# Altium schematic sheet ADRF6780Dev.SchDoc
size A3
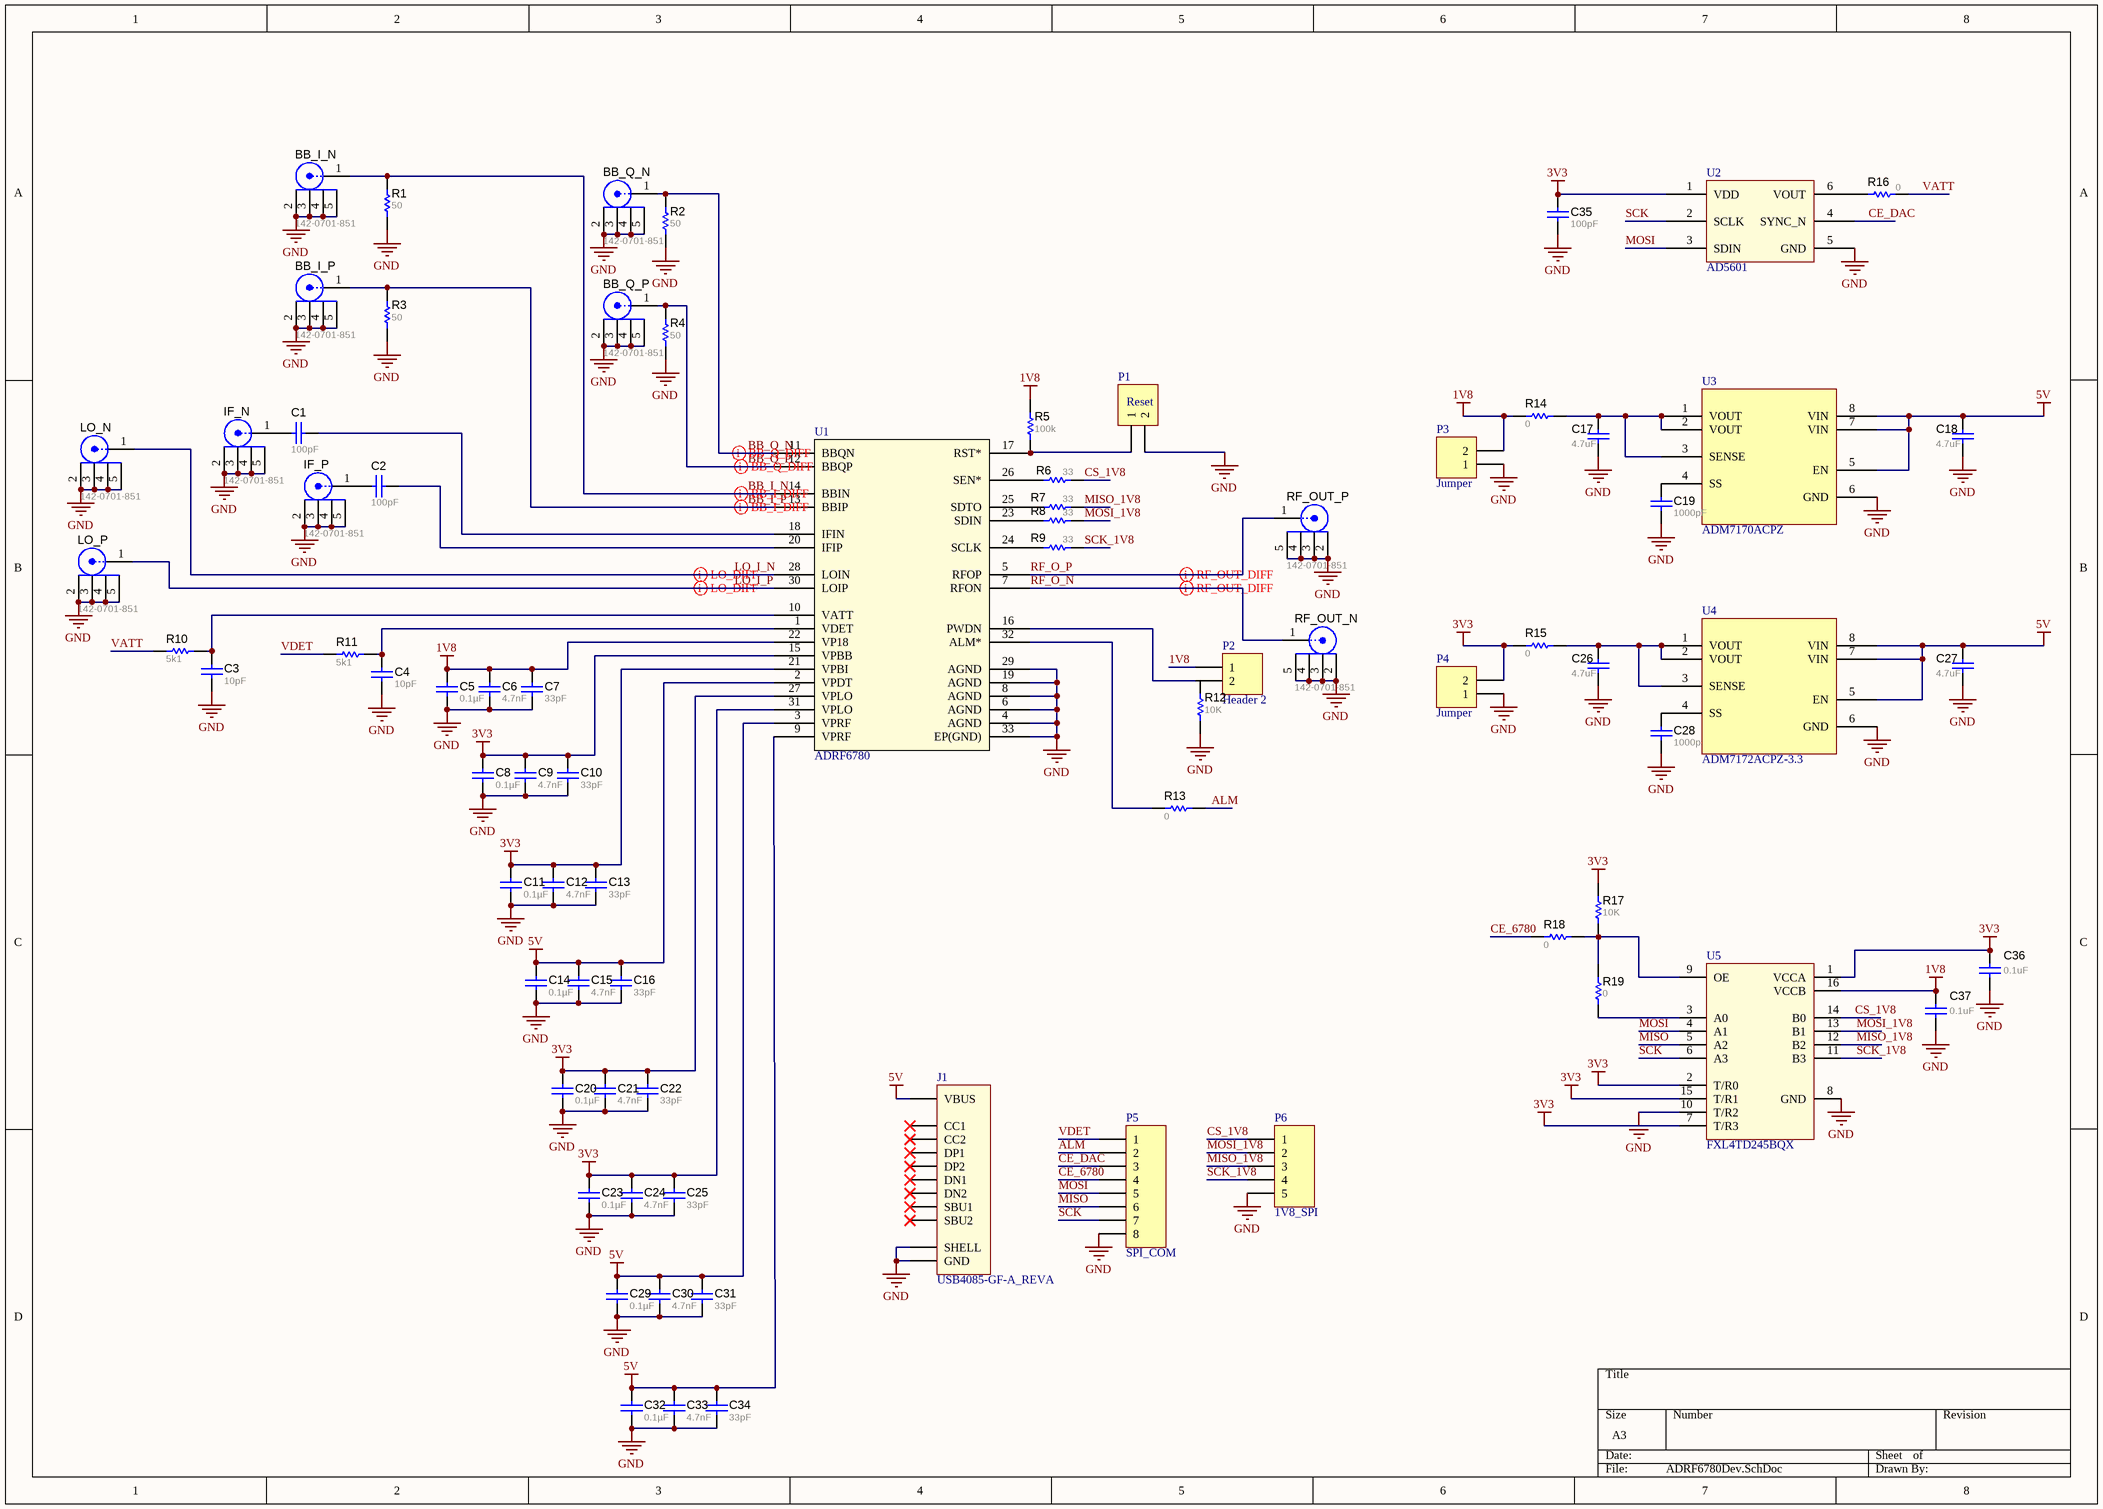
[diagram p0: ADRF6780Dev.SchDoc]

## Parts
BB_I_N  142-0701-851  [Emerson_142-0701-851]
BB_I_P  142-0701-851  [Emerson_142-0701-851]
BB_Q_N  142-0701-851  [Emerson_142-0701-851]
BB_Q_P  142-0701-851  [Emerson_142-0701-851]
C1  ValueDisplayed: 100pF  [0603]  (hidden comment: C0603C101J5GACTU)
C2  ValueDisplayed: 100pF  [0603]  (hidden comment: C0603C101J5GACTU)
C3  ValueDisplayed: 10pF  [0603]  (hidden comment: C1608X5R1A106M080AC)
C4  ValueDisplayed: 10pF  [0603]  (hidden comment: C1608X5R1A106M080AC)
C5  ValueDisplayed: 0.1µF  [0603]  (hidden comment: C1608X5R1A106M080AC)
C6  ValueDisplayed: 4.7nF  [0603]  (hidden comment: C1608X5R1A106M080AC)
C7  ValueDisplayed: 33pF  [0603]  (hidden comment: C1608X5R1A106M080AC)
C8  ValueDisplayed: 0.1µF  [0603]  (hidden comment: C1608X5R1A106M080AC)
C9  ValueDisplayed: 4.7nF  [0603]  (hidden comment: C1608X5R1A106M080AC)
C10  ValueDisplayed: 33pF  [0603]  (hidden comment: C1608X5R1A106M080AC)
C11  ValueDisplayed: 0.1µF  [0603]  (hidden comment: C1608X5R1A106M080AC)
C12  ValueDisplayed: 4.7nF  [0603]  (hidden comment: C1608X5R1A106M080AC)
C13  ValueDisplayed: 33pF  [0603]  (hidden comment: C1608X5R1A106M080AC)
C14  ValueDisplayed: 0.1µF  [0603]  (hidden comment: C1608X5R1A106M080AC)
C15  ValueDisplayed: 4.7nF  [0603]  (hidden comment: C1608X5R1A106M080AC)
C16  ValueDisplayed: 33pF  [0603]  (hidden comment: C1608X5R1A106M080AC)
C17  ValueDisplayed: 4.7uF  [0603]  (hidden comment: C0603C472J5RACTU)
C18  ValueDisplayed: 4.7uF  [0603]  (hidden comment: C0603C472J5RACTU)
C19  ValueDisplayed: 1000pF  [0603]  (hidden comment: C0603C472J5RACTU)
C20  ValueDisplayed: 0.1µF  [0603]  (hidden comment: C1608X5R1A106M080AC)
C21  ValueDisplayed: 4.7nF  [0603]  (hidden comment: C1608X5R1A106M080AC)
C22  ValueDisplayed: 33pF  [0603]  (hidden comment: C1608X5R1A106M080AC)
C23  ValueDisplayed: 0.1µF  [0603]  (hidden comment: C1608X5R1A106M080AC)
C24  ValueDisplayed: 4.7nF  [0603]  (hidden comment: C1608X5R1A106M080AC)
C25  ValueDisplayed: 33pF  [0603]  (hidden comment: C1608X5R1A106M080AC)
C26  ValueDisplayed: 4.7uF  [0603]  (hidden comment: C0603C472J5RACTU)
C27  ValueDisplayed: 4.7uF  [0603]  (hidden comment: C0603C472J5RACTU)
C28  ValueDisplayed: 1000pF  [0603]  (hidden comment: C0603C472J5RACTU)
C29  ValueDisplayed: 0.1µF  [0603]  (hidden comment: C1608X5R1A106M080AC)
C30  ValueDisplayed: 4.7nF  [0603]  (hidden comment: C1608X5R1A106M080AC)
C31  ValueDisplayed: 33pF  [0603]  (hidden comment: C1608X5R1A106M080AC)
C32  ValueDisplayed: 0.1µF  [0603]  (hidden comment: C1608X5R1A106M080AC)
C33  ValueDisplayed: 4.7nF  [0603]  (hidden comment: C1608X5R1A106M080AC)
C34  ValueDisplayed: 33pF  [0603]  (hidden comment: C1608X5R1A106M080AC)
C35  ValueDisplayed: 100pF  [0603]  (hidden comment: C0603C101J5GACTU)
C36  ValueDisplayed: 0.1uF  [0603]  (hidden comment: C0603C472J5RACTU)
C37  ValueDisplayed: 0.1uF  [0603]  (hidden comment: C0603C472J5RACTU)
IF_N  142-0701-851  [Emerson_142-0701-851]
IF_P  142-0701-851  [Emerson_142-0701-851]
J1  USB4085-GF-A_REVA  [GCT_USB4085-GF-A_REVA]
LO_N  142-0701-851  [Emerson_142-0701-851]
LO_P  142-0701-851  [Emerson_142-0701-851]
P1  Reset  [HDR1X2]
P2  Header 2  [HDR1X2]
P3  Jumper  [HDR1X2]
P4  Jumper  [HDR1X2]
P5  SPI_COM  [HDR1X8]
P6  1V8_SPI  [HDR1X5]
R1  ValueDisplayed: 50  [0603]  (hidden comment: CRCW0603100KJNEA)
R2  ValueDisplayed: 50  [0603]  (hidden comment: CRCW0603100KJNEA)
R3  ValueDisplayed: 50  [0603]  (hidden comment: CRCW0603100KJNEA)
R4  ValueDisplayed: 50  [0603]  (hidden comment: CRCW0603100KJNEA)
R5  ValueDisplayed: 100k  [0603]  (hidden comment: CRCW0603100KJNEA)
R6  ValueDisplayed: 33  [0603]  (hidden comment: CRCW0603100KJNEA)
R7  ValueDisplayed: 33  [0603]  (hidden comment: CRCW0603100KJNEA)
R8  ValueDisplayed: 33  [0603]  (hidden comment: CRCW0603100KJNEA)
R9  ValueDisplayed: 33  [0603]  (hidden comment: CRCW0603100KJNEA)
R10  ValueDisplayed: 5k1  [0603L]  (hidden comment: CRCW0603100RFKEA)
R11  ValueDisplayed: 5k1  [0603L]  (hidden comment: CRCW0603100RFKEA)
R12  ValueDisplayed: 10K  [0603]  (hidden comment: CRCW0603100KJNEA)
R13  ValueDisplayed: 0  [0603]  (hidden comment: CRCW0603100KJNEA)
R14  ValueDisplayed: 0  [0603]  (hidden comment: CRCW06030000Z0EA)
R15  ValueDisplayed: 0  [0603]  (hidden comment: CRCW06030000Z0EA)
R16  ValueDisplayed: 0  [0603]  (hidden comment: CRCW0603100KJNEA)
R17  ValueDisplayed: 10K  [0603]  (hidden comment: CRCW06030000Z0EA)
R18  ValueDisplayed: 0  [0603]  (hidden comment: CRCW06030000Z0EA)
R19  ValueDisplayed: 0  [0603]  (hidden comment: CRCW06030000Z0EA)
RF_OUT_N  142-0701-851  [Emerson_142-0701-851]
RF_OUT_P  142-0701-851  [Emerson_142-0701-851]
U1  ADRF6780  [ADRF6780]
U2  AD5601  [AD5601/AD5611/AD5621]
U3  ADM7170ACPZ  [ADM7170ACPZ]
U4  ADM7172ACPZ-3.3  [ADM7170ACPZ]
U5  FXL4TD245BQX  [DQFN-16]

## Nets
1V8: C5.1 C6.1 C7.1 C37.1 P2.1 P3.2 R5.2 R14.1 U1.22(VP18) U5.16(VCCB)
3V3: C8.1 C9.1 C10.1 C11.1 C12.1 C13.1 C20.1 C21.1 C22.1 C23.1 C24.1 C25.1 C35.1 C36.1 P4.2 R15.1 R17.2 U1.15(VPBB) U1.21(VPBI) U1.27(VPLO) U1.31(VPLO) U2.1(VDD) U5.1(VCCA) U5.2(T/R0) U5.7(T/R3) U5.15(T/R1)
5V: C14.1 C15.1 C16.1 C18.1 C27.1 C29.1 C30.1 C31.1 C32.1 C33.1 C34.1 J1.V(VBUS) U1.2(VPDT) U1.3(VPRF) U1.9(VPRF) U3.5(EN) U3.7(VIN) U3.8(VIN) U4.5(EN) U4.7(VIN) U4.8(VIN)
GND: BB_I_N.2 BB_I_N.3 BB_I_N.4 BB_I_N.5 BB_I_P.2 BB_I_P.3 BB_I_P.4 BB_I_P.5 BB_Q_N.2 BB_Q_N.3 BB_Q_N.4 BB_Q_N.5 BB_Q_P.2 BB_Q_P.3 BB_Q_P.4 BB_Q_P.5 C3.2 C4.2 C5.2 C6.2 C7.2 C8.2 C9.2 C10.2 C11.2 C12.2 C13.2 C14.2 C15.2 C16.2 C17.2 C18.2 C19.2 C20.2 C21.2 C22.2 C23.2 C24.2 C25.2 C26.2 C27.2 C28.2 C29.2 C30.2 C31.2 C32.2 C33.2 C34.2 C35.2 C36.2 C37.2 IF_N.2 IF_N.3 IF_N.4 IF_N.5 IF_P.2 IF_P.3 IF_P.4 IF_P.5 J1.G(GND) J1.P(SHELL) LO_N.2 LO_N.3 LO_N.4 LO_N.5 LO_P.2 LO_P.3 LO_P.4 LO_P.5 P1.2 P3.1 P4.1 P5.8 P6.5 R1.1 R2.1 R3.1 R4.1 R12.1 RF_OUT_N.2 RF_OUT_N.3 RF_OUT_N.4 RF_OUT_N.5 RF_OUT_P.2 RF_OUT_P.3 RF_OUT_P.4 RF_OUT_P.5 U1.4(AGND) U1.6(AGND) U1.8(AGND) U1.19(AGND) U1.29(AGND) U1.33(EP(GND)) U2.5(GND) U3.6(GND) U4.6(GND) U5.8(GND) U5.10(T/R2)
ALM: P5.2 R13.2
BB_I_N: BB_I_N.1 R1.2 U1.14(BBIN)
BB_I_P: BB_I_P.1 R3.2 U1.13(BBIP)
BB_Q_N: BB_Q_N.1 R2.2 U1.11(BBQN)
BB_Q_P: BB_Q_P.1 R4.2 U1.12(BBQP)
CE_6780: P5.4 R18.2
CE_DAC: P5.3 U2.4(SYNC_N)
CS_1V8: P6.1 R6.2 U5.14(B0)
LO_I_N: LO_N.1 U1.28(LOIN)
LO_I_P: LO_P.1 U1.30(LOIP)
MISO: P5.6 U5.5(A2)
MISO_1V8: P6.3 R7.2 U5.12(B2)
MOSI: P5.5 U2.3(SDIN) U5.4(A1)
MOSI_1V8: P6.2 R8.2 U5.13(B1)
RF_O_N: RF_OUT_N.1 U1.7(RFON)
RF_O_P: RF_OUT_P.1 U1.5(RFOP)
SCK: P5.7 U2.2(SCLK) U5.6(A3)
SCK_1V8: P6.4 R9.2 U5.11(B3)
VATT: R10.1 R16.1
VDET: P5.1 R11.1
NetC1_1: C1.1 U1.18(IFIN)
NetC1_2: C1.2 IF_N.1
NetC2_1: C2.1 U1.20(IFIP)
NetC2_2: C2.2 IF_P.1
NetC3_1: C3.1 R10.2 U1.10(VATT)
NetC4_1: C4.1 R11.2 U1.1(VDET)
NetC17_1: C17.1 R14.2 U3.1(VOUT) U3.2(VOUT) U3.3(SENSE)
NetC19_1: C19.1 U3.4(SS)
NetC26_1: C26.1 R15.2 U4.1(VOUT) U4.2(VOUT) U4.3(SENSE)
NetC28_1: C28.1 U4.4(SS)
NetP1_1: P1.1 R5.1 U1.17(RST*)
NetP2_2: P2.2 U1.16(PWDN)
NetR6_1: R6.1 U1.26(SEN*)
NetR7_1: R7.1 U1.25(SDTO)
NetR8_1: R8.1 U1.23(SDIN)
NetR9_1: R9.1 U1.24(SCLK)
NetR13_1: R13.1 U1.32(ALM*)
NetR16_2: R16.2 U2.6(VOUT)
NetR17_1: R17.1 R18.1 R19.2 U5.9(OE)
NetR19_1: R19.1 U5.3(A0)

Not connected (* = marked no-connect by the designer): J1 A5(CC1)* A6(DP1)* A7(DN1)* A8(SBU1)* B5(CC2)* B6(DP2)* B7(DN2)* B8(SBU2)*; R12 2

## Layout directives
differential pair; differential pair class RF_OUT: RF_O_N, RF_O_P
differential pair; differential pair class LO_DIFF: LO_I_N, LO_I_P
differential pair; differential pair class BB_Q_DIFF: BB_Q_N, BB_Q_P
differential pair; differential pair class BB_I_DIFF: BB_I_N, BB_I_P

## Library data of the parts
BB_I_N BB_I_P BB_Q_N BB_Q_P IF_N IF_P LO_N LO_P RF_OUT_N RF_OUT_P = 142-0701-851: Connector, SMT, End launch SMA 50 ohm; Manufacturer: Emerson Network Power Connectivity; U/M: EA; PartNumber: 142-0701-851; CompType: Connector; DigiKeyPartNumber: J658-ND; Supplier 1: Newark; Supplier Part Number 1: 99F6798; RoHS: Y; PackageReference: SMA; MountType: SMT; ComponentLink1Description: Datasheet Link; ComponentLink1URL: https://emersonconnectivity.com/OA_MEDIA/specs/pi-1420701851.pdf; Publisher: National Semiconductor; LatestRevisionDate: 2011-04-27; LatestRevisionNote: Added Alternate PartNumber and Alternate Manufacturer parameters.; Alternate Manufacturer: -; Alternate PartNumber: -
C1 C2 C35 = C0603C101J5GACTU: CAP, CERM, 100 pF, 50 V, +/- 5%, C0G/NP0, 0603; Manufacturer: Kemet; Polarized: N; TaMax_C: 125; TaMin_C: -55; Tolerance_%: 5; VDC_V: 50; Cap_F: 0.0000000001; CompType: Capacitor; Value: 100pF; Value1: Unknown; Value2: 50V; U/M: EA; SizeArea_mm2: 1.28; SizeAreaWB_mm2: 4.68; SizeX_mm: 1.6; SizeY_mm: 0.8; SizeZ_mm: 1; AEC Category: Q200; Cap_Case: 0603; MountType: SMT; Technology: Ceramic; PartNumber: C0603C101J5GACTU; SymbolVersion: 2008-07-09; RoHS: Y; PackageReference: 0603; Published: 2008-06-19; Publisher: Texas Instruments; LatestRevisionDate: 2016-11-28; ComponentLink1Description: Datasheet link; ComponentLink1URL: http://www.kemet.com/kemet/web/homepage/kechome.nsf/vapubfiles/F3102_Y5V.pdf/$file/F3102_Y5V.pdf; TempCo: C0G/NP0; Supplier 1: Digi-Key; Supplier Part Number 1: 399-1061-1-ND; Supplier 2: Mouser; Supplier Part Number 2: 80-C0603C101J5G; Supplier 3: Farnell; Supplier Part Number 3: 1414603; AEC Qualified: ?
C3-C16 C20-C25 C29-C34 = C1608X5R1A106M080AC: CAP, CERM, 10 µF, 10 V, +/- 20%, X5R, 0603; Manufacturer: TDK; ESR_ohm: 0.0078; IRMS_A: 1.85; Polarized: N; TaMax_C: 85; TaMin_C: -55; Tolerance_%: 20; VDC_V: 10; Cap_F: 0.00001; CompType: Capacitor; Value: 10uF; U/M: EA; Value1: 0.0078 ohm; Value2: 10V; AEC Category: Q200; Cap_Case: 0603; MountType: SMT; Technology: Ceramic; PartNumber: C1608X5R1A106M080AC; SymbolVersion: 2008-07-09; RoHS: Y; PackageReference: 0603; Published: 2008-06-19; Publisher: Texas Instruments; LatestRevisionDate: 2016-03-08; ComponentLink1Description: Datasheet link; ComponentLink1URL: http://www.tdk.com/pdf/general_B11.pdf; TempCo: X5R; Supplier 1: Digi-Key; Supplier Part Number 1: 445-6853-1-ND; Supplier 2: Mouser; Supplier Part Number 2: 810-C1608X5R1A106M; Supplier 3: Farnell; Supplier Part Number 3: 1962113; AEC Qualified: ?
C17-C19 C26-C28 C36 C37 = C0603C472J5RACTU: CAP, CERM, 4700 pF, 50 V, +/- 5%, X7R, 0603; Manufacturer: Kemet; Polarized: N; TaMax_C: 125; TaMin_C: -55; Tolerance_%: 5; VDC_V: 50; Cap_F: 0.0000000047; CompType: Capacitor; Value: 4700pF; Value1: Unknown; Value2: 50V; U/M: EA; AEC Category: Q200; SizeArea_mm2: 1.28; SizeAreaWB_mm2: 4.68; SizeX_mm: 1.6; SizeY_mm: 0.8; SizeZ_mm: 1; Cap_Case: 0603; MountType: SMT; Technology: Ceramic; PartNumber: C0603C472J5RACTU; SymbolVersion: 2008-07-09; RoHS: Y; PackageReference: 0603; Published: 2008-06-19; Publisher: Texas Instruments; LatestRevisionDate: 2016-11-28; ComponentLink1Description: Datasheet link; ComponentLink1URL: http://www.kemet.com/kemet/web/homepage/kechome.nsf/vapubfiles/F3102_Y5V.pdf/$file/F3102_Y5V.pdf; TempCo: X7R; Supplier 1: Digi-Key; Supplier Part Number 1: 399-1088-1-ND; Supplier 2: Mouser; Supplier Part Number 2: 80-C0603C472J5R; Supplier 3: Farnell; Supplier Part Number 3: 9934952; AEC Qualified: ?
J1 = USB4085-GF-A_REVA: USB-C (USB TYPE-C) USB 2.0 Receptacle Connector 24 (16+8 Dummy) Position Through Hole, Right Angle, low cost, 3.46mm profile, 16 pin, horizontal, Top mount; MF: Global Connector Technology; SnapEDA_Link: https://www.snapeda.com/parts/USB4085-GF-A/Global%20Connector%20Technology/view-part/2780390/?ref=snap; Check_prices: https://www.snapeda.com/parts/USB4085-GF-A/Global%20Connector%20Technology/view-part/2780390/?ref=eda; Price: None; MP: USB4085-GF-A; Value: *; Purchase-URL: https://pricing.snapeda.com/search/part/USB4085-GF-A/?ref=eda; Availability: Warning; Package: Package
P1-P4 = Header 2: Header, 2-Pin; LatestRevisionDate: 17-Jul-2002; LatestRevisionNote: Re-released for DXP Platform.; Publisher: Altium Limited
P5 = Header 8: Header, 8-Pin; LatestRevisionDate: 17-Jul-2002; LatestRevisionNote: Re-released for DXP Platform.; Publisher: Altium Limited
P6 = Header 5: Header, 5-Pin; LatestRevisionDate: 17-Jul-2002; LatestRevisionNote: Re-released for DXP Platform.; Publisher: Altium Limited
R1-R9 R12 R13 R16 = CRCW0603100KJNEA: RES, 100 k, 5%, 0.1 W, 0603; Manufacturer: Vishay-Dale; CompType: Resistor; Tolerance_%: 5; VDC_V: 75; Power_W: 0.1; Res_ohm: 100000; Value: 100k; U/M: EA; Value2: 0.1W; EIA_Code: E24; TempCo: 200 ppm/C; SizeArea_mm2: 1.28; SizeX_mm: 1.6; SizeY_mm: 0.8; SizeZ_mm: 1; AEC Category: Q200; PartNumber: CRCW0603100KJNEA; SymbolVersion: 2009-05-29; Technology: Thick Film; MountType: SMT; RoHS: Y; PackageReference: 0603; ComponentLink1Description: Datasheet link; ComponentLink1URL: http://www.vishay.com/docs/20035/dcrcwe3.pdf; Publisher: Texas Instruments; LatestRevisionDate: 2016-06-02; Value_Code: 100k; Value1: 5%; Published: 2008-06-26; Supplier 1: Digi-Key; Supplier Part Number 1: 541-100KGCT-ND; Supplier 2: Mouser; Supplier Part Number 2: 71-CRCW0603J-100K-E3; Supplier 3: Farnell; Supplier Part Number 3: 1692517; AEC Qualified: ?
R10 R11 = CRCW0603100RFKEA: RES, 100, 1%, 0.1 W, 0603; Manufacturer: Vishay-Dale; CompType: Resistor; Tolerance_%: 1; VDC_V: 75; Power_W: 0.1; Res_ohm: 100; Value: 100; U/M: EA; Value_Code: 100R; Value2: 0.1W; EIA_Code: E96; TempCo: 100 ppm/C; SizeArea_mm2: 1.28; SizeX_mm: 1.6; SizeY_mm: 0.8; AEC Category: Q200; PartNumber: CRCW0603100RFKEA; SymbolVersion: 2009-05-29; Technology: Thick Film; MountType: SMT; RoHS: Y; PackageReference: 0603; ComponentLink1Description: Datasheet link; ComponentLink1URL: http://www.vishay.com/docs/20035/dcrcwe3.pdf; Publisher: Texas Instruments; LatestRevisionDate: 2016-11-02; Value1: 1%; Published: 2008-06-26; Supplier 1: Digi-Key; Supplier Part Number 1: 541-100HCT-ND; SizeZ_mm: 1; Supplier 2: Mouser; Supplier Part Number 2: 71-CRCW0603-100-E3; Supplier 3: Farnell; Supplier Part Number 3: 1469752; AEC Qualified: ?
R14 R15 R18 R19 = CRCW06030000Z0EA: RES, 0, 5%, 0.1 W, 0603; Manufacturer: Vishay-Dale; CompType: Resistor; Tolerance_%: 5; VDC_V: 75; Power_W: 0.1; Value: 0; U/M: EA; Value_Code: 0000; Value2: 0.1W; EIA_Code: E24; TempCo: 200 ppm/C; SizeArea_mm2: 1.28; SizeX_mm: 1.6; SizeY_mm: 0.8; SizeZ_mm: 1; AEC Category: Q200; PartNumber: CRCW06030000Z0EA; SymbolVersion: 2009-05-29; Res_ohm: 0; Technology: Thick Film; MountType: SMT; RoHS: Y; PackageReference: 0603; ComponentLink1Description: Datasheet link; ComponentLink1URL: http://www.vishay.com/docs/20035/dcrcwe3.pdf; Publisher: Texas Instruments; LatestRevisionDate: 2016-11-02; Value1: 5%; Published: 2008-06-26; Supplier 1: Digi-Key; Supplier Part Number 1: 541-0.0GCT-ND; Supplier 2: Mouser; Supplier Part Number 2: 71-CRCW0603-0-E3; Supplier 3: Farnell; Supplier Part Number 3: 1469739; AEC Qualified: ?
R17 = CRCW06030000Z0EA: RES, 0, 5%, 0.1 W, 0603; Manufacturer: Vishay-Dale; CompType: Resistor; Tolerance_%: 5; VDC_V: 75; Power_W: 0.1; Res_ohm: 0; Value: 0; U/M: EA; Value_Code: 0000; Value2: 0.1W; EIA_Code: E24; TempCo: 200 ppm/C; SizeArea_mm2: 1.28; SizeX_mm: 1.6; SizeY_mm: 0.8; SizeZ_mm: 1; AEC Category: Q200; PartNumber: CRCW06030000Z0EA; SymbolVersion: 2009-05-29; Technology: Thick Film; MountType: SMT; RoHS: Y; PackageReference: 0603; ComponentLink1Description: Datasheet link; ComponentLink1URL: http://www.vishay.com/docs/20035/dcrcwe3.pdf; Publisher: Texas Instruments; LatestRevisionDate: 2016-11-02; Value1: 5%; Published: 2008-06-26; Supplier 1: Digi-Key; Supplier Part Number 1: 541-0.0GCT-ND; Supplier 2: Mouser; Supplier Part Number 2: 71-CRCW0603-0-E3; Supplier 3: Farnell; Supplier Part Number 3: 1469739; AEC Qualified: ?
U2 = AD5601: 2.7 V to 5.5 V, <100 μA, 8-/10-/12-Bit / nanoDAC, SPI Interface in SC70
U3 = ADM7170ACPZ: 500 mA, Ultralow Noise, High PSRR, / Fast Transient Response CMOS LDO
U5 = FXL4TD245BQX: Voltage Level Translator Bidirectional 1 Circuit 4 Channel 16-DQFN (2.5x3.5); MF: ON Semiconductor; Availability: Good; Mouser-Purchase-URL: https://snapeda.com/shop?store=Mouser&id=1863498; Value: *; SnapEDA_Link: https://www.snapeda.com/parts/FXL4TD245BQX/ON%20Semiconductor/view-part/1863498/?ref=snap; Price: None; Package: WFQFN-16 ON Semiconductor; MP: FXL4TD245BQX; DigiKey-Purchase-URL: https://snapeda.com/shop?store=DigiKey&id=1863498